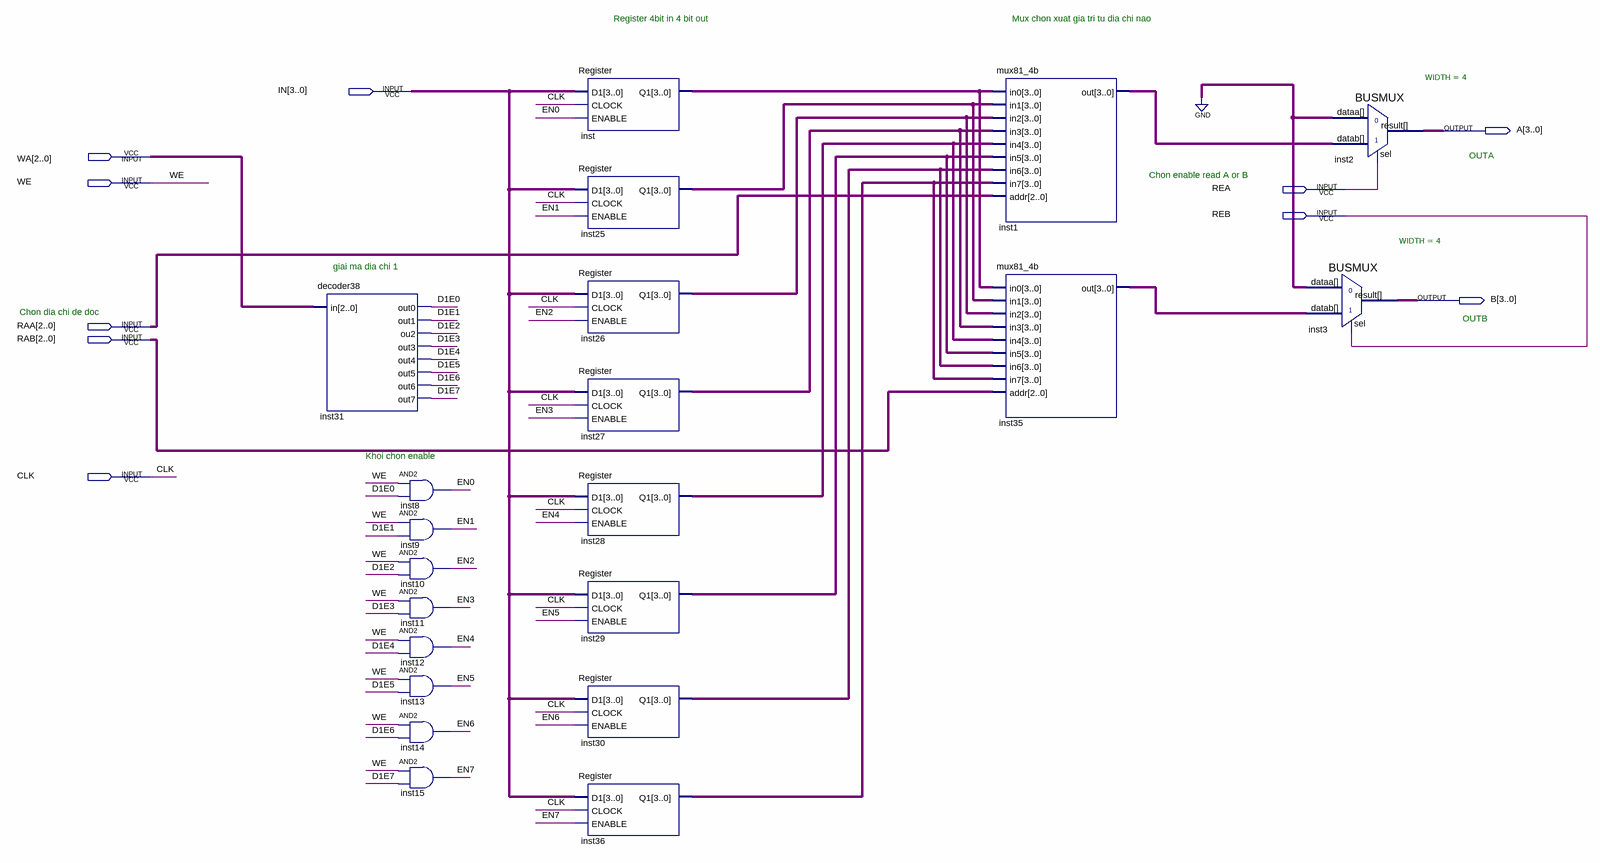
[diagram p0: schematic sheet]
// Quartus schematic Block3.bdf as structural Verilog: 21 symbols, 10 pins
module Block3 (
  input  [3:0] IN,
  input  [2:0] WA,
  input  WE,
  input  REA,
  input  REB,
  input  [2:0] RAA,
  input  [2:0] RAB,
  input  CLK,
  output [3:0] A,
  output [3:0] B
);

  wire D1E0, D1E1, D1E2, D1E3, D1E4, D1E5, D1E6, D1E7, EN0, EN1, EN2, EN3, EN4, EN5, EN6, EN7;
  wire [3:0] inst1_out, inst25_q1, inst26_q1, inst27_q1, inst28_q1, inst29_q1, inst30_q1, inst35_out,
       inst36_q1, inst_q1;

  decoder38 inst31 (
    .in(WA), .out0(D1E0), .out1(D1E1), .ou2(D1E2), .out3(D1E3), .out4(D1E4), .out5(D1E5), .out6(D1E6),
    .out7(D1E7));
  and inst8 (EN0, WE, D1E0);
  and inst9 (EN1, WE, D1E1);
  and inst10 (EN2, WE, D1E2);
  and inst11 (EN3, WE, D1E3);
  and inst12 (EN4, WE, D1E4);
  and inst13 (EN5, WE, D1E5);
  and inst14 (EN6, WE, D1E6);
  and inst15 (EN7, WE, D1E7);
  Register inst (.D1(IN), .CLOCK(CLK), .ENABLE(EN0), .Q1(inst_q1));
  Register inst25 (.D1(IN), .CLOCK(CLK), .ENABLE(EN1), .Q1(inst25_q1));
  Register inst26 (.D1(IN), .CLOCK(CLK), .ENABLE(EN2), .Q1(inst26_q1));
  Register inst27 (.D1(IN), .CLOCK(CLK), .ENABLE(EN3), .Q1(inst27_q1));
  Register inst28 (.D1(IN), .CLOCK(CLK), .ENABLE(EN4), .Q1(inst28_q1));
  Register inst29 (.D1(IN), .CLOCK(CLK), .ENABLE(EN5), .Q1(inst29_q1));
  Register inst30 (.D1(IN), .CLOCK(CLK), .ENABLE(EN6), .Q1(inst30_q1));
  Register inst36 (.D1(IN), .CLOCK(CLK), .ENABLE(EN7), .Q1(inst36_q1));
  mux81_4b inst1 (
    .in0(inst_q1), .in1(inst25_q1), .in2(inst26_q1), .in3(inst27_q1), .in4(inst28_q1), .in5(inst29_q1),
    .in6(inst30_q1), .in7(inst36_q1), .addr(RAA), .out(inst1_out));
  mux81_4b inst35 (
    .in0(inst_q1), .in1(inst25_q1), .in2(inst26_q1), .in3(inst27_q1), .in4(inst28_q1), .in5(inst29_q1),
    .in6(inst30_q1), .in7(inst36_q1), .addr(RAB), .out(inst35_out));
  BUSMUX #(.WIDTH(4)) inst3 (.datab(inst35_out), .sel(REB), .dataa(4'b0000), .result(B));
  BUSMUX #(.WIDTH(4)) inst2 (.datab(inst1_out), .sel(REA), .dataa(4'b0000), .result(A));

  // Notes on the sheet:
  //   Register 4bit in 4 bit out
  //   Mux chon xuat gia tri tu dia chi nao
  //   OUTA
  //   Chon enable read A or B
  //   giai ma dia chi 1
  //   Chon dia chi de doc
  //   OUTB
  //   Khoi chon enable
endmodule
